# EAGLE design Rocket-Control5 (EAGLE 8.1.0)
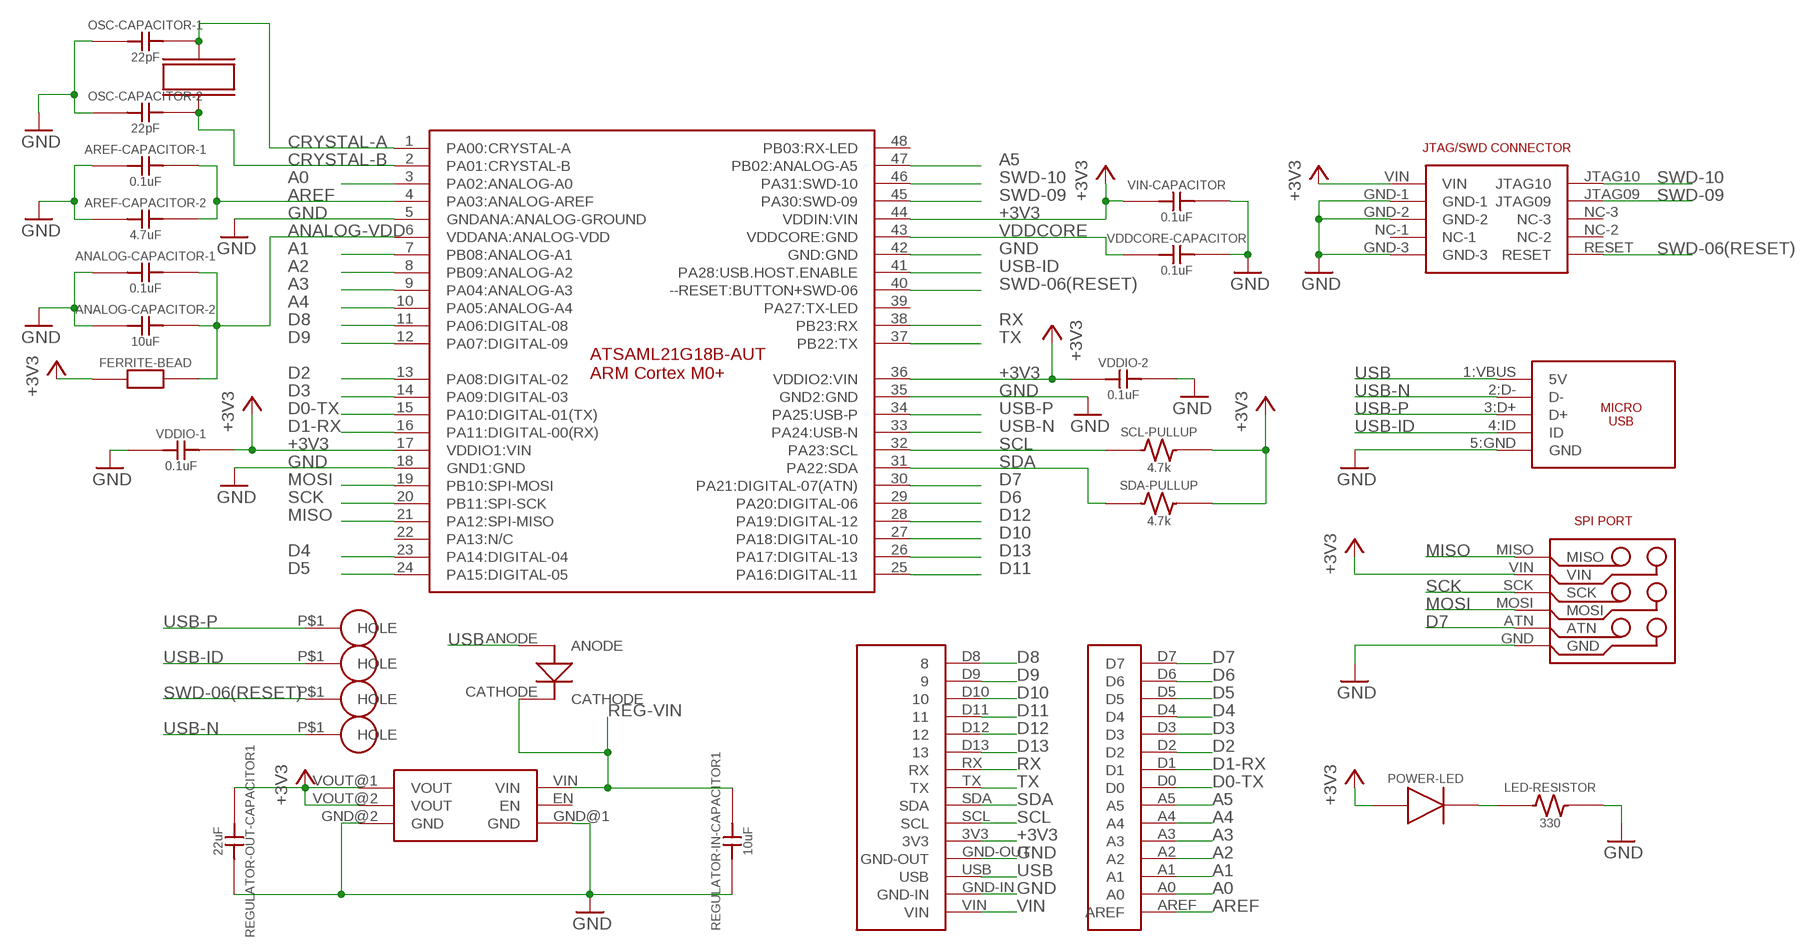
[diagram p0: schematic, sheet 1]

## Parts
ANALOG-CAPACITOR-1  0.1uF  CAPACITORC0402  [C0402]
ANALOG-CAPACITOR-2  10uF  CAPACITORC0402  [C0402]
AREF-CAPACITOR-1  0.1uF  CAPACITORC0402  [C0402]
AREF-CAPACITOR-2  4.7uF  CAPACITORC0402  [C0402]
ARM-CORTEX-MO+  ATSAML21G18B-AUT  [TQFP48]
FERRITE-BEAD  BLM18PG471SN1D  [C0603]
HEADER-SIDE-A  HEADER-SIDE-A  [HEADER-SIDE-A]
HEADER-SIDE-B  HEADER-SIDE-B  [HEADER-SIDE-B]
JTAG-CONNECTOR  JTAG-MINI  [JTAG-MINI]
LED-RESISTOR  330  RESISTORC0603  [C0603]
MICRO-USB-CONNECTOR  10118194-0001LF  [10118194-0001LF]
OSC-CAPACITOR-1  22pF  CAPACITORC0603  [C0603]
OSC-CAPACITOR-2  22pF  CAPACITORC0603  [C0603]
POWER-LED  APTD1608ZGC  [C0603]
REGULATOR-IN-CAPACITOR1  10uF  CAPACITORC0402  [C0402]
REGULATOR-OUT-CAPACITOR1  22uF  CAPACITORC0402  [C0402]
SCL-PULLUP  4.7k  RESISTORC0402  [C0402]
SDA-PULLUP  4.7k  RESISTORC0402  [C0402]
SPI-PORT  SPI-PORT  [SPI-PORT]
U$1  ABS07-32.768KHZ-T  [ABS07-32.768KHZ-T]
U$2  MIC5528  [MIC5528]
U$3  DIODE-STANDARD  [DIODE-STANDARD]
U$4  HEADER-HOLE  [HEADER-HOLE]
U$5  HEADER-HOLE  [HEADER-HOLE]
U$6  HEADER-HOLE  [HEADER-HOLE]
U$7  HEADER-HOLE  [HEADER-HOLE]
VDDCORE-CAPACITOR  0.1uF  CAPACITORC0402  [C0402]
VDDIO-1  0.1uF  CAPACITORC0402  [C0402]
VDDIO-2  0.1uF  CAPACITORC0402  [C0402]
VIN-CAPACITOR  0.1uF  CAPACITORC0402  [C0402]

## Nets
+3V3: ARM-CORTEX-MO+.17(VDDIO1:VIN) ARM-CORTEX-MO+.36(VDDIO2:VIN) ARM-CORTEX-MO+.44(VDDIN:VIN) FERRITE-BEAD.1 HEADER-SIDE-B.3V3 JTAG-CONNECTOR.VIN POWER-LED.1 REGULATOR-OUT-CAPACITOR1.1(A) SCL-PULLUP.2 SDA-PULLUP.2 SPI-PORT.VIN U$2.VOUT@1(VOUT) U$2.VOUT@2(VOUT) VDDIO-1.2(B) VDDIO-2.2(B) VIN-CAPACITOR.1(A)
A0: ARM-CORTEX-MO+.3(PA02:ANALOG-A0) HEADER-SIDE-A.A0
A1: ARM-CORTEX-MO+.7(PB08:ANALOG-A1) HEADER-SIDE-A.A1
A2: ARM-CORTEX-MO+.8(PB09:ANALOG-A2) HEADER-SIDE-A.A2
A3: ARM-CORTEX-MO+.9(PA04:ANALOG-A3) HEADER-SIDE-A.A3
A4: ARM-CORTEX-MO+.10(PA05:ANALOG-A4) HEADER-SIDE-A.A4
A5: ARM-CORTEX-MO+.47(PB02:ANALOG-A5) HEADER-SIDE-A.A5
ANALOG-VDD: ANALOG-CAPACITOR-1.2(B) ANALOG-CAPACITOR-2.2(B) ARM-CORTEX-MO+.6(VDDANA:ANALOG-VDD) FERRITE-BEAD.2
AREF: AREF-CAPACITOR-1.2(B) AREF-CAPACITOR-2.2(B) ARM-CORTEX-MO+.4(PA03:ANALOG-AREF) HEADER-SIDE-A.AREF
CRYSTAL-A: ARM-CORTEX-MO+.1(PA00:CRYSTAL-A) OSC-CAPACITOR-1.2(B) U$1.P$2
CRYSTAL-B: ARM-CORTEX-MO+.2(PA01:CRYSTAL-B) OSC-CAPACITOR-2.2(B) U$1.P$1
D0-TX: ARM-CORTEX-MO+.15(PA10:DIGITAL-01(TX)) HEADER-SIDE-A.D0
D1-RX: ARM-CORTEX-MO+.16(PA11:DIGITAL-00(RX)) HEADER-SIDE-A.D1
D2: ARM-CORTEX-MO+.13(PA08:DIGITAL-02) HEADER-SIDE-A.D2
D3: ARM-CORTEX-MO+.14(PA09:DIGITAL-03) HEADER-SIDE-A.D3
D4: ARM-CORTEX-MO+.23(PA14:DIGITAL-04) HEADER-SIDE-A.D4
D5: ARM-CORTEX-MO+.24(PA15:DIGITAL-05) HEADER-SIDE-A.D5
D6: ARM-CORTEX-MO+.29(PA20:DIGITAL-06) HEADER-SIDE-A.D6
D7: ARM-CORTEX-MO+.30(PA21:DIGITAL-07(ATN)) HEADER-SIDE-A.D7 SPI-PORT.ATN
D8: ARM-CORTEX-MO+.11(PA06:DIGITAL-08) HEADER-SIDE-B.D8
D9: ARM-CORTEX-MO+.12(PA07:DIGITAL-09) HEADER-SIDE-B.D9
D10: ARM-CORTEX-MO+.27(PA18:DIGITAL-10) HEADER-SIDE-B.D10
D11: ARM-CORTEX-MO+.25(PA16:DIGITAL-11) HEADER-SIDE-B.D11
D12: ARM-CORTEX-MO+.28(PA19:DIGITAL-12) HEADER-SIDE-B.D12
D13: ARM-CORTEX-MO+.26(PA17:DIGITAL-13) HEADER-SIDE-B.D13
GND: ANALOG-CAPACITOR-1.1(A) ANALOG-CAPACITOR-2.1(A) AREF-CAPACITOR-1.1(A) AREF-CAPACITOR-2.1(A) ARM-CORTEX-MO+.5(GNDANA:ANALOG-GROUND) ARM-CORTEX-MO+.18(GND1:GND) ARM-CORTEX-MO+.35(GND2:GND) ARM-CORTEX-MO+.42(GND:GND) HEADER-SIDE-B.GND-IN HEADER-SIDE-B.GND-OUT JTAG-CONNECTOR.GND-1 JTAG-CONNECTOR.GND-2 JTAG-CONNECTOR.GND-3 LED-RESISTOR.2 MICRO-USB-CONNECTOR.5:GND(GND) OSC-CAPACITOR-1.1(A) OSC-CAPACITOR-2.1(A) REGULATOR-IN-CAPACITOR1.1(A) REGULATOR-OUT-CAPACITOR1.2(B) SPI-PORT.GND U$2.GND@1(GND) U$2.GND@2(GND) VDDCORE-CAPACITOR.2(B) VDDIO-1.1(A) VDDIO-2.1(A) VIN-CAPACITOR.2(B)
MISO: ARM-CORTEX-MO+.21(PA12:SPI-MISO) SPI-PORT.MISO
MOSI: ARM-CORTEX-MO+.19(PB10:SPI-MOSI) SPI-PORT.MOSI
N$2: LED-RESISTOR.1 POWER-LED.2
REG-VIN: REGULATOR-IN-CAPACITOR1.2(B) U$2.VIN U$3.CATHODE
RX: ARM-CORTEX-MO+.38(PB23:RX) HEADER-SIDE-B.RX
SCK: ARM-CORTEX-MO+.20(PB11:SPI-SCK) SPI-PORT.SCK
SCL: ARM-CORTEX-MO+.32(PA23:SCL) HEADER-SIDE-B.SCL SCL-PULLUP.1
SDA: ARM-CORTEX-MO+.31(PA22:SDA) HEADER-SIDE-B.SDA SDA-PULLUP.1
SWD-06(RESET): ARM-CORTEX-MO+.40(--RESET:BUTTON+SWD-06) JTAG-CONNECTOR.RESET U$5.P$1(HOLE)
SWD-09: ARM-CORTEX-MO+.45(PA30:SWD-09) JTAG-CONNECTOR.JTAG09
SWD-10: ARM-CORTEX-MO+.46(PA31:SWD-10) JTAG-CONNECTOR.JTAG10
TX: ARM-CORTEX-MO+.37(PB22:TX) HEADER-SIDE-B.TX
USB: HEADER-SIDE-B.USB MICRO-USB-CONNECTOR.1:VBUS(5V) U$3.ANODE
USB-ID: ARM-CORTEX-MO+.41(PA28:USB.HOST.ENABLE) MICRO-USB-CONNECTOR.4:ID(ID) U$4.P$1(HOLE)
USB-N: ARM-CORTEX-MO+.33(PA24:USB-N) MICRO-USB-CONNECTOR.2:D-(D-) U$6.P$1(HOLE)
USB-P: ARM-CORTEX-MO+.34(PA25:USB-P) MICRO-USB-CONNECTOR.3:D+(D+) U$7.P$1(HOLE)
VDDCORE: ARM-CORTEX-MO+.43(VDDCORE:GND) VDDCORE-CAPACITOR.1(A)
VIN: HEADER-SIDE-B.VIN
Unconnected: ARM-CORTEX-MO+.22(PA13:N/C) ARM-CORTEX-MO+.39(PA27:TX-LED) ARM-CORTEX-MO+.48(PB03:RX-LED) JTAG-CONNECTOR.NC-1 JTAG-CONNECTOR.NC-2 JTAG-CONNECTOR.NC-3 U$2.EN

## Library data of the parts
ANALOG-CAPACITOR-1 AREF-CAPACITOR-1 VDDCORE-CAPACITOR VDDIO-1 VDDIO-2 VIN-CAPACITOR = RocketControlBoard:CAPACITOR: SMD Capacitor; DESC: CAP CER 0.1UF 10V X5R 0402; DIGIKEY#: 1276-1022-1-ND; MANF: Samsung Electro-Mechanics America, Inc.; MANF#: CL05A104KP5NNNC
ANALOG-CAPACITOR-2 REGULATOR-IN-CAPACITOR1 = RocketControlBoard:CAPACITOR: SMD Capacitor; DESC: CAP CER 10UF 10V X5R 0402; DIGIKEY#: 1276-1450-1-ND; MANF: Samsung Electro-Mechanics America, Inc.; MANF#: CL05A106MP5NUNC
AREF-CAPACITOR-2 = RocketControlBoard:CAPACITOR: SMD Capacitor; DESC: CAP CER 0.47UF 10V X5R 0402; DIGIKEY#: 1276-1173-1-ND; MANF: Samsung Electro-Mechanics America, Inc.; MANF#: CL05A474KP5NNNC
ARM-CORTEX-MO+ = RocketControlBoard:ATSAML21G18B-AUT: ARM Cortex M0+ Microcontroller; DESC: IC MCU 32BIT 256KB FLASH 48TQFP; DIGIKEY#: 1611-ATSAML21G18B-AUTCT-ND; MANF: Microchip Technology; MANF#: ATSAML21G18B-AUT
FERRITE-BEAD = RocketControlBoard:BLM18PG471SN1D: Ferrite Bead; DESC: FERRITE BEAD 470 OHM 0603 1LN; DIGIKEY#: 490-5223-1-ND; MANF: Murata Electronics North America; MANF#: BLM18PG471SN1D
HEADER-SIDE-A = RocketControlBoard:HEADER-SIDE-A: 2.54mm header strip; DESC: CONN HEADER .100" SNGL STR 40POS; NOTE: One strip appears on the BOM.
HEADER-SIDE-B = RocketControlBoard:HEADER-SIDE-B: 2.54mm header strip; DESC: CONN HEADER .100" SNGL STR 40POS; DIGIKEY#: S1011EC-40-ND; MANF: Sullins Connector Solutions; MANF#: PRPC040SAAN-RC
JTAG-CONNECTOR = RocketControlBoard:JTAG-MINI: JTAG/SWD Connector (Programming Port); DESC: CONN HEADER 10POS UNSHD VERT T/H; DIGIKEY#: 609-3712-ND; MANF: Amphenol FCI; MANF#: 20021111-00010T4LF
LED-RESISTOR = RocketControlBoard:RESISTOR: SMD Resistor; DESC: RES SMD 330 OHM 5% 1/10W 0603; DIGIKEY#: 1276-5050-1-ND; MANF: Samsung Electro-Mechanics America, Inc.; MANF#: RC1608J331CS
MICRO-USB-CONNECTOR = RocketControlBoard:10118194-0001LF: Micro USB Port; DESC: CONN USB MICRO B RECPT SMT R/A; DIGIKEY#: 609-4618-1-ND; MANF: Amphenol FCI; MANF#: 10118194-0001LF
OSC-CAPACITOR-1 OSC-CAPACITOR-2 = RocketControlBoard:CAPACITOR: SMD Capacitor; DESC: CAP CER 22PF 50V NP0 0603; DIGIKEY#: 1276-2229-1-ND; MANF: Samsung Electro-Mechanics America, Inc.; MANF#: CL10C220JB8NNWC
POWER-LED = RocketControlBoard:APTD1608ZGC: Diode; DESC: LED GREEN CLEAR 0603 SMD; DIGIKEY#: 754-1547-1-ND; MANF: Kingbright; MANF#: APTD1608ZGC
REGULATOR-OUT-CAPACITOR1 = RocketControlBoard:CAPACITOR: SMD Capacitor; DESC: CAP CER 22UF 6.3V X5R 0402; DIGIKEY#: 1276-6834-1-ND; MANF: Samsung Electro-Mechanics America, Inc.; MANF#: CL05A226MQ5QUNC
SCL-PULLUP SDA-PULLUP = RocketControlBoard:RESISTOR: SMD Resistor; DESC: RES SMD 4.7K OHM 5% 1/10W 0603; DIGIKEY#: 1276-5078-1-ND; MANF: Samsung Electro-Mechanics America, Inc.; MANF#: RC1608J472CS
SPI-PORT = RocketControlBoard:SPI-PORT: 3x2 2.54mm sized SPI port; NOTE: The 40 piece header fits the SPI port.
U$1 = RocketControlBoard:ABS07-32.768KHZ-T; DESC: CRYSTAL 32.7680KHZ 12.5PF SMD; DESCRIPTION: Crystal; DIGIKEY#: 535-9542-1-ND; MANF: Abracon LLC; MANF#: ABS07-32.768KHZ-T
U$2 = RocketControlBoard:MIC5528; DESC: IC REG LDO 3.3V 0.5A 6TDFN; DIGIKEY#: MIC5528-3.3YMT-TR; MANF: Microchip Technology; MANF#: MIC5528-3.3YMT-TR
U$3 = RocketControlBoard:DIODE-STANDARD; DESC: DIODE GEN PURP 20V 1A MINI3; DIGIKEY#: DB3X207K0LCT-ND; MANF: Panasonic Electronic Components; MANF#: DB3X207K0L
U$4-U$7 = RocketControlBoard:HEADER-HOLE: Single 2.54mm sized header hole

## Board
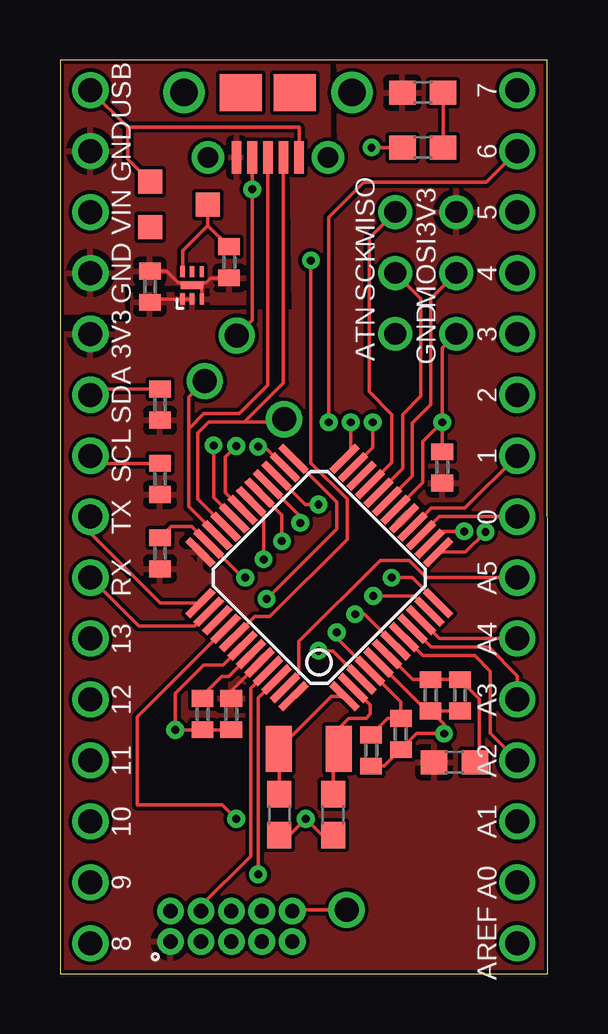
[diagram p1: board, top side]
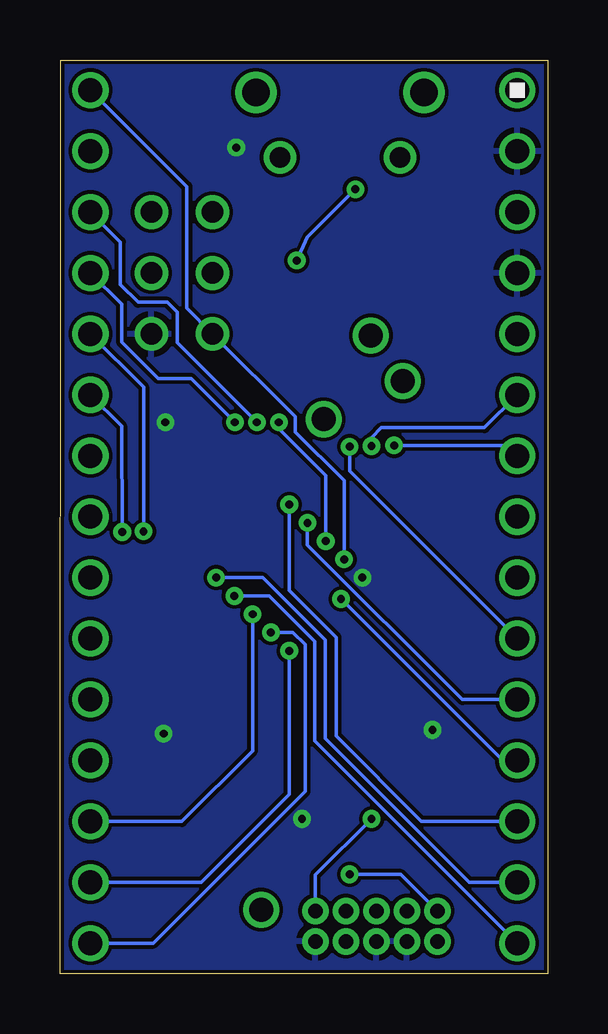
[diagram p2: board, bottom side, seen from below]

Size 20.32 x 38.09 mm. Coordinates in mm from the lower left corner, seen from the top.
Outline: 0,0 20.32,0 20.3,38.09 0,38.09 0,0
Copper layers (1*16): Top 0.035mm / dielectric 1.5mm / Bottom 0.035mm
Design rules "pcbway *": minimum track width 6mil, minimum drill 12mil, track to track 6mil, track to pad 6mil, pad to pad 6mil, via to via 6mil, smd to smd 6mil, copper to edge 6mil, drill to drill 6mil, minimum pad ring 10mil, minimum via ring 8mil, stop-mask expansion 4mil, vias tented up to drill 150mil, thermal gap 10mil

### Footprints (pad centres in the part's own frame; a part is rotated, then mirrored left to right if it is on the bottom)
C0402 = smd 0.7 x 0.9: 1 -0.65,0; 2 0.65,0
TQFP48 = smd 0.3 x 1.5: 1 -2.75,-4.25; 2 -2.25,-4.25; 3 -1.75,-4.25; 4 -1.25,-4.25; 5 -0.75,-4.25; 6 -0.25,-4.25; 7 0.25,-4.25; 8 0.75,-4.25; 9 1.25,-4.25; 10 1.75,-4.25; 11 2.25,-4.25; 12 2.75,-4.25; 25 2.75,4.25; 26 2.25,4.25; 27 1.75,4.25; 28 1.25,4.25; 29 0.75,4.25; 30 0.25,4.25; 31 -0.25,4.25; 32 -0.75,4.25; 33 -1.25,4.25; 34 -1.75,4.25; 35 -2.25,4.25; 36 -2.75,4.25 | smd 1.5 x 0.3: 13 4.25,-2.75; 14 4.25,-2.25; 15 4.25,-1.75; 16 4.25,-1.25; 17 4.25,-0.75; 18 4.25,-0.25; 19 4.25,0.25; 20 4.25,0.75; 21 4.25,1.25; 22 4.25,1.75; 23 4.25,2.25; 24 4.25,2.75; 37 -4.25,2.75; 38 -4.25,2.25; 39 -4.25,1.75; 40 -4.25,1.25; 41 -4.25,0.75; 42 -4.25,0.25; 43 -4.25,-0.25; 44 -4.25,-0.75; 45 -4.25,-1.25; 46 -4.25,-1.75; 47 -4.25,-2.25; 48 -4.25,-2.75
C0603 = smd 1.1 x 1: 1 -0.85,0; 2 0.85,0
HEADER-SIDE-A = drill 1: A0 0,-12.7; A1 0,-10.16; A2 0,-7.62; A3 0,-5.08; A4 0,-2.54; A5 0,0; AREF 0,-15.24; D0 0,2.54; D1 0,5.08; D2 0,7.62; D3 0,10.16; D4 0,12.7; D5 0,15.24; D6 0,17.78; D7 0,20.32
HEADER-SIDE-B = drill 1: 3V3 -12.7,0; D8 -38.1,0; D9 -35.56,0; D10 -33.02,0; D11 -30.48,0; D12 -27.94,0; D13 -25.4,0; GND-IN -5.08,0; GND-OUT -10.16,0; RX -22.86,0; SCL -17.78,0; SDA -15.24,0; TX -20.32,0; USB -2.54,0; VIN -7.62,0
JTAG-MINI = drill 0.6: GND-1 0.635,4.445; GND-2 0.635,3.175; GND-3 0.635,0.635; JTAG09 1.905,4.445; JTAG10 1.905,5.715; NC-1 0.635,1.905; NC-2 1.905,1.905; NC-3 1.905,3.175; RESET 1.905,0.635; VIN 0.635,5.715
10118194-0001LF = smd 1.35 x 0.4: 1:VBUS 2.7,1.3; 2:D- 2.7,0.65; 3:D+ 2.7,0; 4:ID 2.7,-0.65; 5:GND 2.7,-1.3 | drill 0.85: NC1 2.7,2.5; NC6 2.7,-2.5 | drill 1.15: NC2 0,3.5; NC5 0,-3.5 | smd 1.55 x 1.75: NC3 0,1.125; NC4 0,-1.125
SPI-PORT = drill 0.9: ATN 0,0; GND 2.54,0; MISO 0,5.08; MOSI 2.54,2.54; SCK 0,2.54; VIN 2.54,5.08
ABS07-32.768KHZ-T = smd 1.1 x 1.9: P$1 -1.25,0; P$2 1.25,0
MIC5528 = smd 0.18 x 0.45: EN 0.4,0.575; GND@1 0.4,-0.575; N/C 0,0.575; VIN -0.4,0.575; VOUT@1 -0.4,-0.575; VOUT@2 0,-0.575 | smd 0.94 x 0.3: GND@2 0,0
DIODE-STANDARD = smd 1 x 1: ANODE -0.95,-2.4; CATHODE 0,0; N/C 0.95,-2.4
HEADER-HOLE = drill 1: P$1 0,0

### Placement (x,y rotation side)
ANALOG-CAPACITOR-1  15.44,11.61 90 top
ANALOG-CAPACITOR-2  16.66,11.61 90 top
AREF-CAPACITOR-1  12.96,9.31 90 top
AREF-CAPACITOR-2  14.2,9.99 90 top
ARM-CORTEX-MO+  10.79,16.51 45 top
FERRITE-BEAD  16.43,8.81 0 top
HEADER-SIDE-A  19.05,16.51 0 top
HEADER-SIDE-B  1.27,39.37 90 top
JTAG-CONNECTOR  10.31,0.71 90 top
LED-RESISTOR  15.11,34.44 180 top
MICRO-USB-CONNECTOR  8.66,36.73 270 top
OSC-CAPACITOR-1  9.14,6.63 90 top
OSC-CAPACITOR-2  11.38,6.63 90 top
POWER-LED  15.11,36.73 0 top
REGULATOR-IN-CAPACITOR1  7.05,29.65 90 top
REGULATOR-OUT-CAPACITOR1  3.75,28.64 90 top
SCL-PULLUP  4.17,20.62 270 top
SDA-PULLUP  4.17,23.72 270 top
SPI-PORT  13.97,26.67 0 top
U$1  10.36,9.37 180 top
U$2  5.51,28.7 0 top
U$3  6.16,32.07 270 top
U$4  7.37,26.61 0 top
U$5  11.94,2.67 0 top
U$6  9.33,23.11 0 top
U$7  6.03,24.7 0 top
VDDCORE-CAPACITOR  5.94,10.82 270 top
VDDIO-1  4.17,17.53 270 top
VDDIO-2  15.93,21.11 270 top
VIN-CAPACITOR  7.14,10.82 270 top

### Tracks (layer width: path | path; a pad name or v marks a point on that pad's centre or on a via)
+3V3
  Top 0.152: ARM-CORTEX-MO+.44 7.14,11.79 VIN-CAPACITOR.1 | U$2.VOUT@2 U$2.VOUT@1 3.75,28.12 REGULATOR-OUT-CAPACITOR1.1
  pour Top: -0.89,-1.04 21.39,-1.04 21.39,39.12 11.58,39.12 11.61,33.63 9.64,33.73 9.72,27.64 7.56,27.62 5.68,27.61 5.69,28.36 3.01,28.35 2.97,27.14 -0.91,27.05
A0  (via drill 0.33)
  Top 0.152: ARM-CORTEX-MO+.3 11.37,13.46 v10.77,13.46
  Bottom 0.152: HEADER-SIDE-A.A0 14.43,3.81 10.77,7.47 v10.77,13.46
A1  (via drill 0.33)
  Top 0.152: ARM-CORTEX-MO+.7 12.67,14.99 v12.29,14.99
  Bottom 0.152: HEADER-SIDE-A.A1 15.24,6.35 12.29,9.3 v12.29,14.99
A2
  Top 0.152: ARM-CORTEX-MO+.8 15.11,13.26 17.27,13.26 17.93,12.6 17.93,10.01 HEADER-SIDE-A.A2
A3
  Top 0.152: ARM-CORTEX-MO+.9 15.46,13.61 17.86,13.61 19.05,12.42 HEADER-SIDE-A.A3
A4
  Top 0.152: HEADER-SIDE-A.A4 15.81,13.97 ARM-CORTEX-MO+.10
A5
  Top 0.152: ARM-CORTEX-MO+.47 9.96,12.49 9.96,13.84 13.34,17.22 14.55,17.22 15.27,16.51 HEADER-SIDE-A.A5
ANALOG-VDD
  Top 0.152: ARM-CORTEX-MO+.6 14.69,12.26 ANALOG-CAPACITOR-1.2 ANALOG-CAPACITOR-2.2 17.48,11.45 17.48,9.01 FERRITE-BEAD.2
AREF  (via drill 0.33)
  Top 0.152: v11.53,14.22 11.53,14.01 ARM-CORTEX-MO+.4 14.2,11.33 AREF-CAPACITOR-2.2 13.65,10.64 AREF-CAPACITOR-1.2
  Bottom 0.152: HEADER-SIDE-A.AREF 16.43,1.27 10.11,7.59 10.11,13.72 10.62,14.22 v11.53,14.22
CRYSTAL-A
  Top 0.152: ARM-CORTEX-MO+.1 11.3,11.56 U$1.P$2 9.14,9.34 OSC-CAPACITOR-1.2
CRYSTAL-B
  Top 0.152: ARM-CORTEX-MO+.2 12.93,11.19 12.93,10.82 12.75,10.64 12.04,10.64 11.61,10.22 U$1.P$1 11.38,9.14 OSC-CAPACITOR-2.2
D0-TX
  Top 0.152: ARM-CORTEX-MO+.15 15.81,19.05 HEADER-SIDE-A.D0
D1-RX
  Top 0.152: ARM-CORTEX-MO+.16 15.46,19.41 16.87,19.41 HEADER-SIDE-A.D1
D2  (via drill 0.33)
  Top 0.152: ARM-CORTEX-MO+.13 16.89,17.57 v17.73,18.41
  Bottom 0.152: HEADER-SIDE-A.D2 17.75,22.84 v17.73,18.41
D3  (via drill 0.33)
  Top 0.152: ARM-CORTEX-MO+.14 15.91,18.44 v16.84,18.44
  Bottom 0.152: HEADER-SIDE-A.D3 16.84,24.46 v16.84,18.44
D4  (via drill 0.33)
  Top 0.152: ARM-CORTEX-MO+.23 13.03,21.93 v13.03,22.99
  Bottom 0.152: HEADER-SIDE-A.D4 17.75,27.91 17.75,26.34 16.23,24.82 14.86,24.82 v13.03,22.99
D5  (via drill 0.33)
  Top 0.152: ARM-CORTEX-MO+.24 12.12,21.72 v12.12,22.99
  Bottom 0.152: HEADER-SIDE-A.D5 17.8,30.5 17.8,28.73 17.07,27.99 15.85,27.99 15.44,27.58 15.44,26.31 v12.12,22.99
D6  (via drill 0.33)
  Top 0.152: ARM-CORTEX-MO+.29 9.25,19.12 v9.25,18.03 | v11.2,22.99 11.2,31.55 12.65,32.99 17.75,32.99 HEADER-SIDE-A.D6
  Bottom 0.152: v11.2,22.99 11.2,22.73 9.25,20.78 v9.25,18.03
D7  (via drill 0.33)
  Top 0.152: ARM-CORTEX-MO+.30 8.48,19.18 v8.48,17.27
  Bottom 0.152: v8.48,17.27 8.48,20.55 10.52,22.58 10.52,23.22 SPI-PORT.ATN 15.04,27.74 15.04,32.82 HEADER-SIDE-A.D7
D8  (via drill 0.33)
  Top 0.152: ARM-CORTEX-MO+.11 14.74,15.75 v13.06,15.75
  Bottom 0.152: HEADER-SIDE-B.D8 9.7,9.7 9.7,13.84 11.61,15.75 v13.06,15.75
D9  (via drill 0.33)
  Top 0.152: ARM-CORTEX-MO+.12 14.68,16.51 v13.82,16.51
  Bottom 0.152: HEADER-SIDE-B.D9 3.28,3.81 9.27,9.8 9.27,13.92 11.86,16.51 v13.82,16.51
D10  (via drill 0.33)
  Top 0.152: ARM-CORTEX-MO+.27 10.22,19.56 v10.77,19.56
  Bottom 0.152: v10.77,19.56 10.77,15.98 8.81,14.02 8.81,9.91 5.26,6.35 HEADER-SIDE-B.D10
D11  (via drill 0.33)
  Top 0.152: ARM-CORTEX-MO+.25 11.53,19.66 11.53,18.54 v8.61,15.62
  Bottom 0.152: HEADER-SIDE-B.D11 1.88,8.89 v8.61,15.62
D12  (via drill 0.33)
  Top 0.152: ARM-CORTEX-MO+.28 10.01,19.07 v10.01,18.8
  Bottom 0.152: HEADER-SIDE-B.D12 3.56,11.43 10.01,17.88 v10.01,18.8
D13  (via drill 0.33)
  Top 0.152: v8.26,21.97 8.52,21.97 ARM-CORTEX-MO+.26
  Bottom 0.152: HEADER-SIDE-B.D13 8.26,20.95 v8.26,21.97
GND  (via drill 0.33)
  Top 0.152: ARM-CORTEX-MO+.18 15.11,20.47 15.11,22.17 v15.93,22.99 | SPI-PORT.GND 15.93,26.09 v15.93,22.99 | v4.8,10.16 4.8,11.68 5.99,12.88 6.81,12.88 ARM-CORTEX-MO+.42 | 14.25,11.99 ARM-CORTEX-MO+.5 15.29,10.96 ANALOG-CAPACITOR-1.1 | VDDIO-2.1 v15.93,22.99 | v7.72,16.51 7.61,16.51 ARM-CORTEX-MO+.35 5.48,18.64 4.63,18.64 VDDIO-1.1 | LED-RESISTOR.2 v12.98,34.44 | v4.8,10.16 v4.81,10.17 | VIN-CAPACITOR.2 VDDCORE-CAPACITOR.2 v4.8,10.16 | ANALOG-CAPACITOR-1.1 ANALOG-CAPACITOR-2.1 | ANALOG-CAPACITOR-1.1 16,10.4 v16,10.01 14.87,10.01 AREF-CAPACITOR-2.1 13.52,8.65 AREF-CAPACITOR-1.1 | OSC-CAPACITOR-1.1 9.56,5.78 v10.24,6.45 10.91,5.78 OSC-CAPACITOR-2.1 | U$2.GND@2 5.91,28.7 U$2.GND@1 | U$2.GND@2 5.38,28.82 4.92,28.82 4.45,29.29 REGULATOR-OUT-CAPACITOR1.2 | U$2.GND@2 5.63,28.82 6.09,28.82 6.28,29 REGULATOR-IN-CAPACITOR1.1
  pour Bottom: -0.46,-0.58 20.95,-0.58 20.95,38.43 -0.46,38.43
  pour Top: -0.97,27.51 2.65,27.53 2.62,28.75 6.02,28.75 6.02,27.94 9.33,27.94 9.08,34.07 9.3,34.07 11.23,34.04 11.23,34.85 11.2,39.19 -0.97,39.19
MISO
  Top 0.152: ARM-CORTEX-MO+.21 13.82,21.3 13.82,23.32 12.88,24.26 12.88,30.66 SPI-PORT.MISO
MOSI
  Top 0.152: ARM-CORTEX-MO+.19 14.68,20.75 14.68,22.96 15.44,23.72 15.44,28.14 SPI-PORT.MOSI
N$2
  Top 0.152: POWER-LED.2 LED-RESISTOR.1
REG-VIN
  Top 0.152: U$2.VIN 5.11,30.14 6.16,31.19 | 6.16,31.19 U$3.CATHODE | 6.16,31.19 REGULATOR-IN-CAPACITOR1.2
RX
  Top 0.152: ARM-CORTEX-MO+.38 5.61,14.5 3.28,14.5 HEADER-SIDE-B.RX
SCK
  Top 0.152: ARM-CORTEX-MO+.20 14.28,21.05 14.28,23.32 15.04,24.08 15.04,28.14 SPI-PORT.SCK
SCL  (via drill 0.33)
  Top 0.152: ARM-CORTEX-MO+.32 6.4,19.84 v6.4,22.02 | SCL-PULLUP.1 1.58,21.27 HEADER-SIDE-B.SCL
  Bottom 0.152: HEADER-SIDE-B.SCL 1.7,22.02 v6.4,22.02
SDA  (via drill 0.33)
  Top 0.152: ARM-CORTEX-MO+.31 6.88,20.07 6.88,21.54 v7.34,22 | SDA-PULLUP.1 1.51,24.37 HEADER-SIDE-B.SDA
  Bottom 0.152: HEADER-SIDE-B.SDA 2.64,22.76 6.93,22.76 7.34,22.35 v7.34,22
SWD-06(RESET)  (via drill 0.33)
  Top 0.152: ARM-CORTEX-MO+.40 3.23,10.71 3.23,7.04 6.76,7.04 v7.34,6.45 | JTAG-CONNECTOR.RESET 9.73,2.67 U$5.P$1
  Bottom 0.152: JTAG-CONNECTOR.RESET 9.68,4.12 v7.34,6.45
SWD-09
  Top 0.152: ARM-CORTEX-MO+.45 7.95,11.9 7.95,4.9 5.87,2.82 JTAG-CONNECTOR.JTAG09
SWD-10  (via drill 0.33)
  Top 0.152: ARM-CORTEX-MO+.46 8.26,11.49 v8.26,4.14
  Bottom 0.152: JTAG-CONNECTOR.JTAG10 6.12,4.14 v8.26,4.14
TX
  Top 0.152: HEADER-SIDE-B.TX 1.27,18.36 4.18,15.45 ARM-CORTEX-MO+.37
USB
  Top 0.152: MICRO-USB-CONNECTOR.1:VBUS 9.96,35.28 2.82,35.28 | 2.82,35.28 HEADER-SIDE-B.USB | 2.82,35.28 2.82,33.96 U$3.ANODE
USB-ID  (via drill 0.33)
  Top 0.152: ARM-CORTEX-MO+.41 8.11,14.88 8.74,14.88 11.96,18.11 11.96,19.79 10.45,21.3 v10.45,29.73 | MICRO-USB-CONNECTOR.4:ID v8.01,32.7 8.01,27.25 U$4.P$1
  Bottom 0.152: v8.01,32.7 10.01,30.7 v10.45,29.73
USB-N
  Top 0.152: ARM-CORTEX-MO+.33 5.74,19.8 5.74,22.53 6.2,22.99 7.67,22.99 | 7.67,22.99 9.31,24.63 MICRO-USB-CONNECTOR.2:D- | U$6.P$1 9.21,22.99 7.67,22.99
USB-P
  Top 0.152: ARM-CORTEX-MO+.34 5.36,19.47 5.36,22.71 | 5.36,22.71 5.99,23.34 7.47,23.34 8.66,24.54 MICRO-USB-CONNECTOR.3:D+ | U$7.P$1 5.36,24.03 5.36,22.71
VDDCORE
  Top 0.152: ARM-CORTEX-MO+.43 7.03,12.39 6.74,12.39 5.94,11.6 VDDCORE-CAPACITOR.1